# EAGLE design 01 Raspberry Hat 4 Schematic (EAGLE 7.7.0)

## Sheet 1 of 2
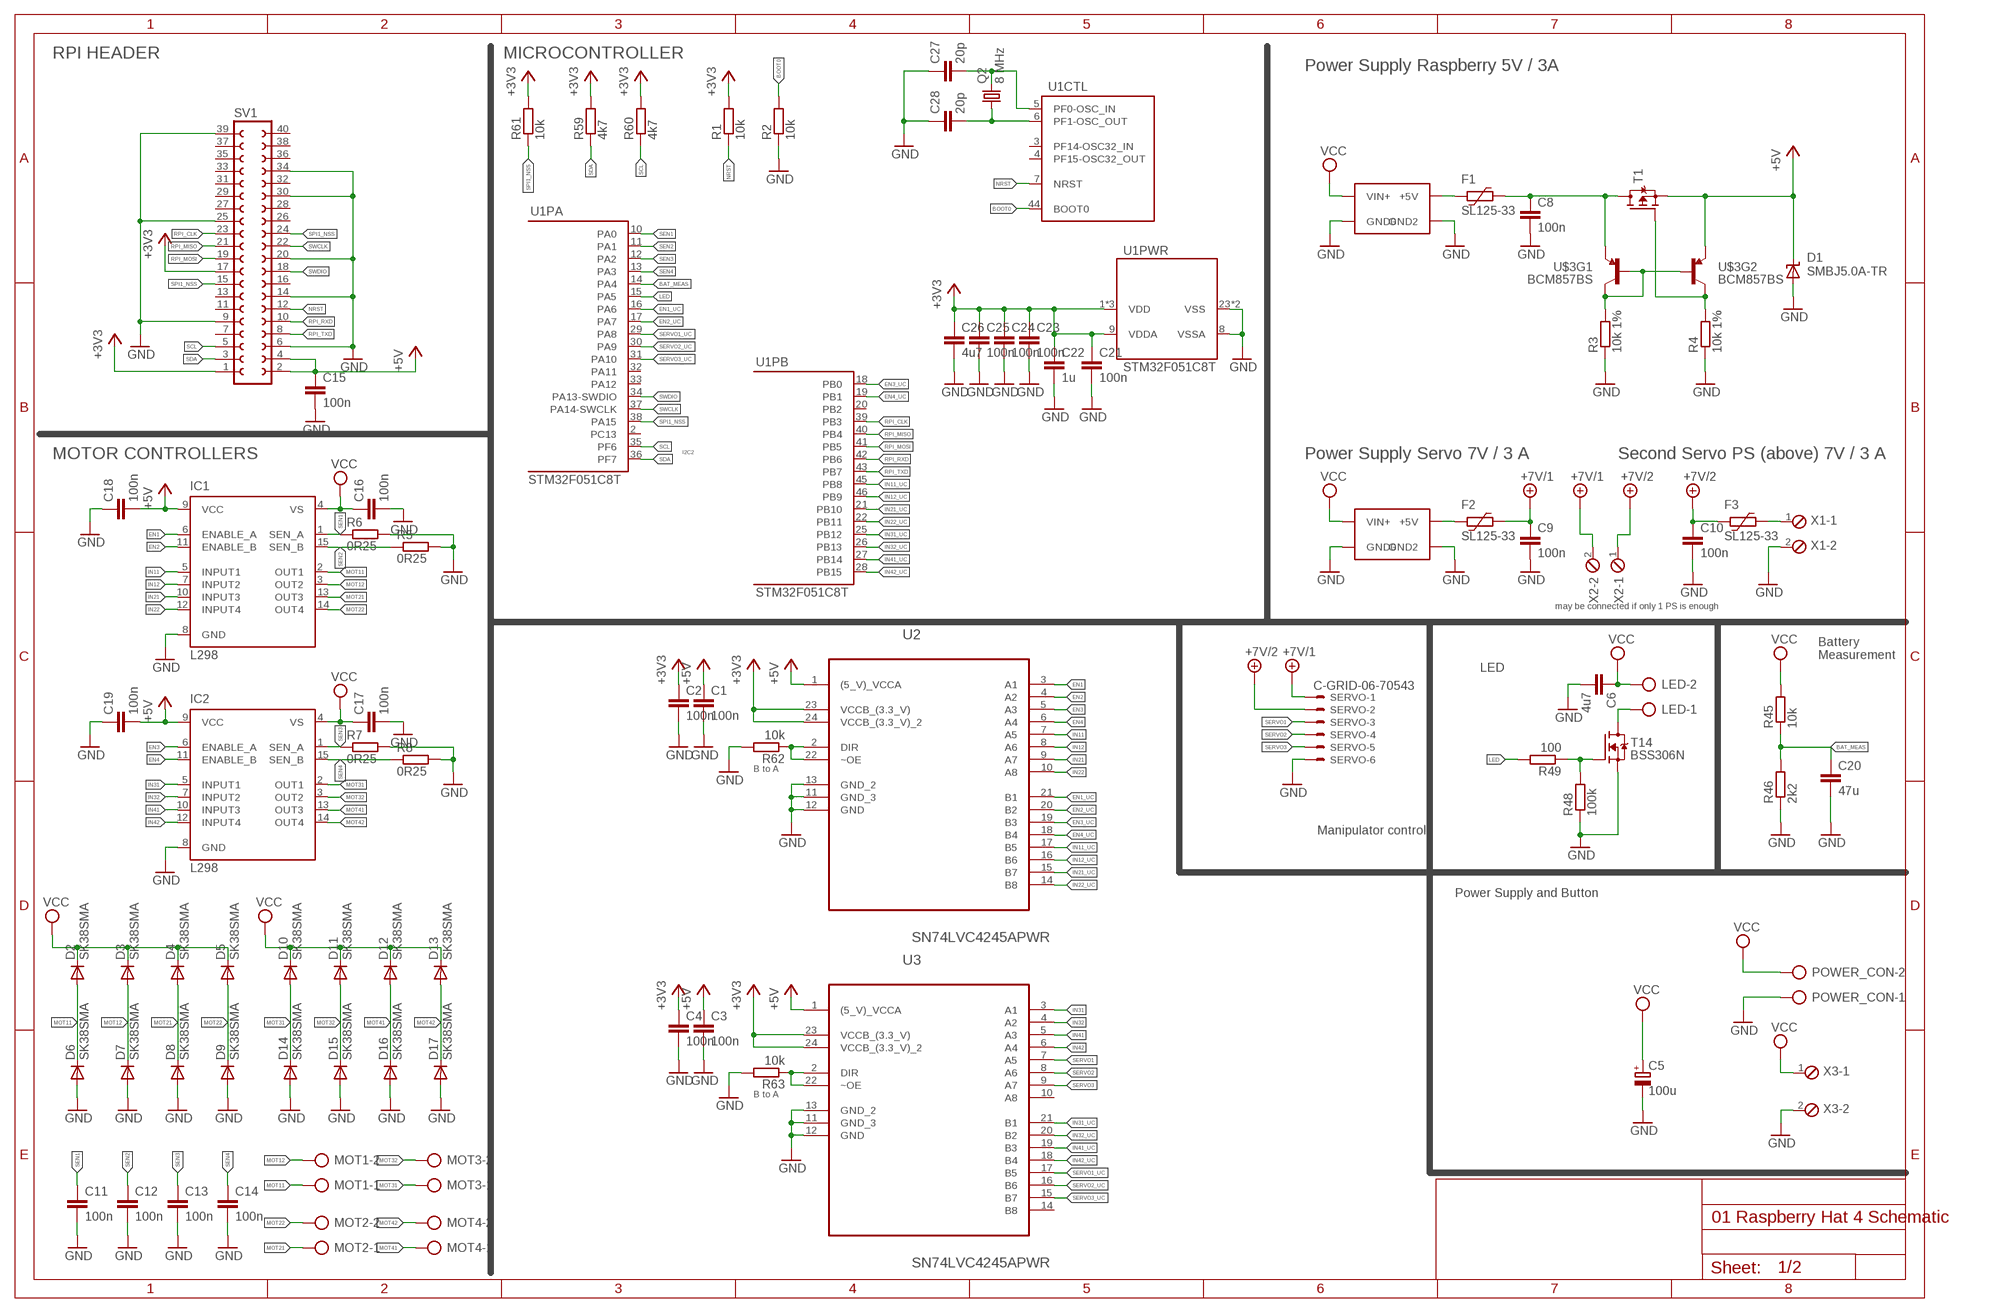
[diagram p0: schematic, sheet 1]

### Parts
C1  100n  C-EUC0805  [C0805]
C2  100n  C-EUC0805  [C0805]
C3  100n  C-EUC0805  [C0805]
C4  100n  C-EUC0805  [C0805]
C5  100u  CPOL-EU153CLV-0807  [153CLV-0807]
C6  4u7  C-EUC0805  [C0805]
C8  100n  C-EUC0805  [C0805]
C9  100n  C-EUC0805  [C0805]
C10  100n  C-EUC0805  [C0805]
C11  100n  C-EUC0805  [C0805]
C12  100n  C-EUC0805  [C0805]
C13  100n  C-EUC0805  [C0805]
C14  100n  C-EUC0805  [C0805]
C15  100n  C-EUC0805  [C0805]
C16  100n  C-EUC0805  [C0805]
C17  100n  C-EUC0805  [C0805]
C18  100n  C-EUC0805  [C0805]
C19  100n  C-EUC0805  [C0805]
C20  47u  C-EUC0805  [C0805]
C21  100n  C-EUC0805  [C0805]
C22  1u  C-EUC0805  [C0805]
C23  100n  C-EUC0805  [C0805]
C24  100n  C-EUC0805  [C0805]
C25  100n  C-EUC0805  [C0805]
C26  4u7  C-EUC0805  [C0805]
C27  20p  C-EUC0805  [C0805]
C28  20p  C-EUC0805  [C0805]
D1  SMBJ5.0A-TR  SUPPRESSOR-SMBJ  [SMBJ]
D2  SK38SMA  DIODE-DO214AC  [DO214AC]
D3  SK38SMA  DIODE-DO214AC  [DO214AC]
D4  SK38SMA  DIODE-DO214AC  [DO214AC]
D5  SK38SMA  DIODE-DO214AC  [DO214AC]
D6  SK38SMA  DIODE-DO214AC  [DO214AC]
D7  SK38SMA  DIODE-DO214AC  [DO214AC]
D8  SK38SMA  DIODE-DO214AC  [DO214AC]
D9  SK38SMA  DIODE-DO214AC  [DO214AC]
D10  SK38SMA  DIODE-DO214AC  [DO214AC]
D11  SK38SMA  DIODE-DO214AC  [DO214AC]
D12  SK38SMA  DIODE-DO214AC  [DO214AC]
D13  SK38SMA  DIODE-DO214AC  [DO214AC]
D14  SK38SMA  DIODE-DO214AC  [DO214AC]
D15  SK38SMA  DIODE-DO214AC  [DO214AC]
D16  SK38SMA  DIODE-DO214AC  [DO214AC]
D17  SK38SMA  DIODE-DO214AC  [DO214AC]
F1  SL125-33  2920L050  [2920L]
F2  SL125-33  2920L050  [2920L]
F3  SL125-33  2920L050  [2920L]
IC1  L298  [MULTIWATT-15]
IC2  L298  [MULTIWATT-15]
LED  AK500/2  [AK500/2]
MOT1  AK500/2  [AK500/2]
MOT2  AK500/2  [AK500/2]
MOT3  AK500/2  [AK500/2]
MOT4  AK500/2  [AK500/2]
POWER_CON  AK500/2  [AK500/2]
Q2  8 MHz  CRYSTALHC49UP  [HC49UP]
R1  10k  R-EU_M0805  [M0805]
R2  10k  R-EU_M0805  [M0805]
R3  10k 1%  R-EU_M0805  [M0805]
R4  10k 1%  R-EU_M0805  [M0805]
R5  0R25  R-EU_R2512  [R2512]
R6  0R25  R-EU_R2512  [R2512]
R7  0R25  R-EU_R2512  [R2512]
R8  0R25  R-EU_R2512  [R2512]
R45  10k  R-EU_M0805  [M0805]
R46  2k2  R-EU_M0805  [M0805]
R48  100k  R-EU_M0805  [M0805]
R49  100  R-EU_M0805  [M0805]
R59  4k7  R-EU_M0805  [M0805]
R60  4k7  R-EU_M0805  [M0805]
R61  10k  R-EU_M0805  [M0805]
R62  10k  R-EU_M0805  [M0805]
R63  10k  R-EU_M0805  [M0805]
SERVO  C-GRID-06-70543  [70543-06]
SV1  FE20-2  [FE20-2]
T1  MOSFET-P-SOT23  [SOT23]
T14  BSS306N  MOSFET-N-SOT23  [SOT23]
U1  STM32F051C8T  [LQFP48]
U2  SN74LVC4245APWR  [SOP65P640X120-24N]
U3  SN74LVC4245APWR  [SOP65P640X120-24N]
U$2  LM2596_CONVERTER  [LM2596_CONVERTER]
U$3  BCM857BS  [SOT363]
U$4  LM2596_CONVERTER  [LM2596_CONVERTER]
X1  MPT2  [2POL254]
X2  MPT2  [2POL254]
X3  MPT2  [2POL254]

### Nets
+3V3: C2.1 C4.1 C21.1 C22.1 C23.1 C24.1 C25.1 C26.1 R1.2 R59.2 R60.2 R61.2 SV1.1 SV1.17 U1.1(PWR:VDD) U1.9(PWR:VDDA) U1.24(PWR:VDD) U1.48(PWR:VDD) U2.23(VCCB_(3.3_V)) U2.24(VCCB_(3.3_V)_2) U3.23(VCCB_(3.3_V)) U3.24(VCCB_(3.3_V)_2)
+5V: C1.1 C3.1 C15.1 C18.2 C19.2 D1.C IC1.9(VCC) IC2.9(VCC) SV1.2 SV1.4 T1.2(S) U2.1((5_V)_VCCA) U3.1((5_V)_VCCA) U$3.4(E)
+7V/1: C9.1 F2.1 SERVO.1 X2.2
+7V/2: C10.1 F3.2 SERVO.2 X2.1
BAT_MEAS: C20.1 R45.1 R46.2 U1.14(PA:PA4)
BOOT0: R2.2 U1.44(CTL:BOOT0)
EN1: IC1.6(ENABLE_A) U2.3(A1)
EN1_UC: U1.16(PA:PA6) U2.21(B1)
EN2: IC1.11(ENABLE_B) U2.4(A2)
EN2_UC: U1.17(PA:PA7) U2.20(B2)
EN3: IC2.6(ENABLE_A) U2.5(A3)
EN3_UC: U1.18(PB:PB0) U2.19(B3)
EN4: IC2.11(ENABLE_B) U2.6(A4)
EN4_UC: U1.19(PB:PB1) U2.18(B4)
GND: C1.2 C2.2 C3.2 C4.2 C5.- C6.2 C8.2 C9.2 C10.2 C11.2 C12.2 C13.2 C14.2 C15.2 C16.2 C17.2 C18.1 C19.1 C20.2 C21.2 C22.2 C23.2 C24.2 C25.2 C26.2 C27.1 C28.1 D1.A D6.A D7.A D8.A D9.A D14.A D15.A D16.A D17.A IC1.8(GND) IC2.8(GND) POWER_CON.1 R2.1 R3.1 R4.1 R5.2 R6.2 R7.2 R8.2 R46.1 R48.1 R62.2 R63.2 SERVO.6 SV1.6 SV1.9 SV1.14 SV1.20 SV1.25 SV1.30 SV1.34 SV1.39 T14.2(S) U1.8(PWR:VSSA) U1.23(PWR:VSS) U1.47(PWR:VSS) U2.11(GND_3) U2.12(GND) U2.13(GND_2) U3.11(GND_3) U3.12(GND) U3.13(GND_2) U$2.GND1(GND2) U$2.GND(GND0) U$4.GND1(GND2) U$4.GND(GND0) X1.2 X3.2
IN11: IC1.5(INPUT1) U2.7(A5)
IN11_UC: U1.45(PB:PB8) U2.17(B5)
IN12: IC1.7(INPUT2) U2.8(A6)
IN12_UC: U1.46(PB:PB9) U2.16(B6)
IN21: IC1.10(INPUT3) U2.9(A7)
IN21_UC: U1.21(PB:PB10) U2.15(B7)
IN22: IC1.12(INPUT4) U2.10(A8)
IN22_UC: U1.22(PB:PB11) U2.14(B8)
IN31: IC2.5(INPUT1) U3.3(A1)
IN31_UC: U1.25(PB:PB12) U3.21(B1)
IN32: IC2.7(INPUT2) U3.4(A2)
IN32_UC: U1.26(PB:PB13) U3.20(B2)
IN41: IC2.10(INPUT3) U3.5(A3)
IN41_UC: U1.27(PB:PB14) U3.19(B3)
IN42: IC2.12(INPUT4) U3.6(A4)
IN42_UC: U1.28(PB:PB15) U3.18(B4)
LED: R49.2 U1.15(PA:PA5)
MOT11: D2.A D6.C IC1.2(OUT1) MOT1.1
MOT12: D3.A D7.C IC1.3(OUT2) MOT1.2
MOT21: D4.A D8.C IC1.13(OUT3) MOT2.1
MOT22: D5.A D9.C IC1.14(OUT4) MOT2.2
MOT31: D10.A D14.C IC2.2(OUT1) MOT3.1
MOT32: D11.A D15.C IC2.3(OUT2) MOT3.2
MOT41: D12.A D16.C IC2.13(OUT3) MOT4.1
MOT42: D13.A D17.C IC2.14(OUT4) MOT4.2
N$1: R62.1 U2.2(DIR) U2.22(~OE)
N$2: R63.1 U3.2(DIR) U3.22(~OE)
N$3: F1.2 U$2.+5V
N$4: C8.1 F1.1 T1.3(D) U$3.1(E)
N$5: F3.1 X1.1
N$6: R4.2 T1.1(G) U$3.3(C)
N$8: R3.2 U$3.2(B) U$3.5(B) U$3.6(C)
N$10: F2.2 U$4.+5V
N$21: R48.2 R49.1 T14.1(G)
N$24: LED.1 T14.3(D)
N$28: C28.2 Q2.1 U1.6(CTL:PF1-OSC_OUT)
N$29: C27.2 Q2.2 U1.5(CTL:PF0-OSC_IN)
NRST: R1.1 SV1.12 U1.7(CTL:NRST)
RPI_CLK: SV1.23 U1.39(PB:PB3)
RPI_MISO: SV1.21 U1.40(PB:PB4)
RPI_MOSI: SV1.19 U1.41(PB:PB5)
RPI_RXD: SV1.10 U1.42(PB:PB6)
RPI_TXD: SV1.8 U1.43(PB:PB7)
SCL: R60.1 SV1.5 U1.35(PA:PF6)
SDA: R59.1 SV1.3 U1.36(PA:PF7)
SEN1: C11.1 IC1.1(SEN_A) R6.1 U1.10(PA:PA0)
SEN2: C12.1 IC1.15(SEN_B) R5.1 U1.11(PA:PA1)
SEN3: C13.1 IC2.1(SEN_A) R7.1 U1.12(PA:PA2)
SEN4: C14.1 IC2.15(SEN_B) R8.1 U1.13(PA:PA3)
SERVO1: SERVO.3 U3.7(A5)
SERVO1_UC: U1.29(PA:PA8) U3.17(B5)
SERVO2: SERVO.4 U3.8(A6)
SERVO2_UC: U1.30(PA:PA9) U3.16(B6)
SERVO3: SERVO.5 U3.9(A7)
SERVO3_UC: U1.31(PA:PA10) U3.15(B7)
SPI1_NSS: R61.1 SV1.15 SV1.24 U1.38(PA:PA15)
SWCLK: SV1.22 U1.37(PA:PA14-SWCLK)
SWDIO: SV1.18 U1.34(PA:PA13-SWDIO)
VCC: C5.+ C6.1 C16.1 C17.1 D2.C D3.C D4.C D5.C D10.C D11.C D12.C D13.C IC1.4(VS) IC2.4(VS) LED.2 POWER_CON.2 R45.2 U$2.IN+(VIN+) U$4.IN+(VIN+) X3.1
Unconnected: SV1.7 SV1.11 SV1.13 SV1.16 SV1.26 SV1.27 SV1.28 SV1.29 SV1.31 SV1.32 SV1.33 SV1.35 SV1.36 SV1.37 SV1.38 SV1.40 U1.2(PA:PC13) U1.3(CTL:PF14-OSC32_IN) U1.4(CTL:PF15-OSC32_OUT) U1.20(PB:PB2) U1.32(PA:PA11) U1.33(PA:PA12) U3.10(A8) U3.14(B8)

### Notes on the sheet
- RPI HEADER | MICROCONTROLLER
- Power Supply Raspberry 5V / 3A
- I2C2
- MOTOR CONTROLLERS | Power Supply Servo 7V / 3 A | Second Servo PS (above) 7V / 3 A
- may be connected if only 1 PS is enough
- Battery
  Measurement
- LED
- B to A
- Manipulator control
- Power Supply and Button
- B to A

## Sheet 2 of 2
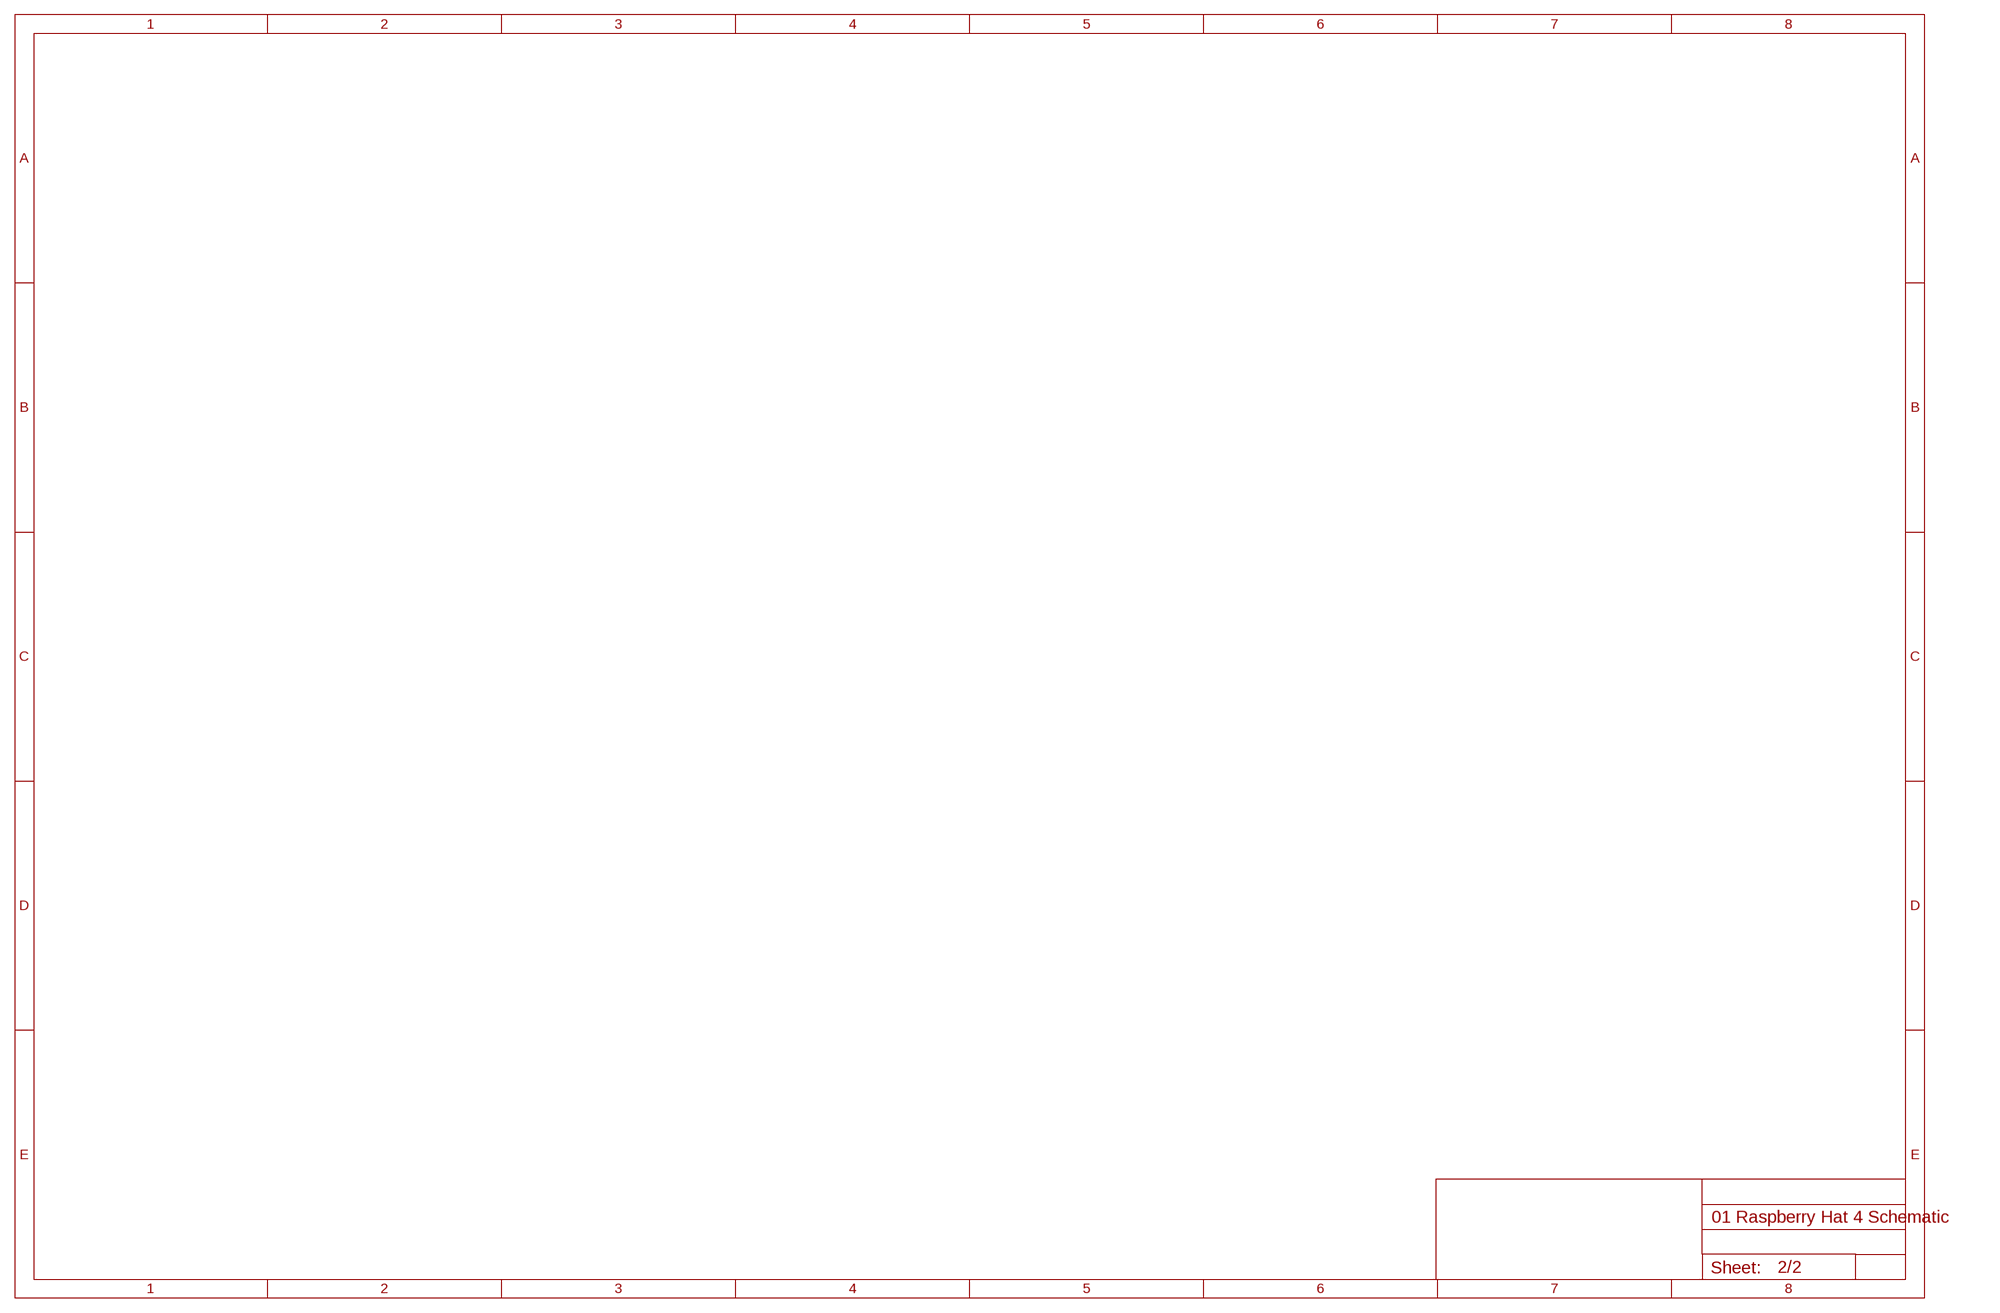
[diagram p1: schematic, sheet 2]

## Library data of the parts
C1-C4 C6 C8-C19 C21-C28 = resistor:C-EU: CAPACITOR, European symbol
C5 = resistor:CPOL-EU: POLARIZED CAPACITOR, European symbol; LINK: http://www.tme.eu/pl/details/sc1e107m0806bvr/kondensatory-elektrolityczne-smd-85c/samwha/
C20 = resistor:C-EU: CAPACITOR, European symbol; LINK: http://www.tme.eu/pl/details/cl21a476mqynnng/kondensatory-mlcc-smd-0805/samsung/
D1 = diode:SUPPRESSOR-: Suppressor diode; LINK: http://www.tme.eu/pl/details/smbj5.0a-tr/diody-transil-smd-jednokierunkowe/st-microelectronics/
D2-D17 = diode:DIODE-: DIODE; LINK: http://www.tme.eu/pl/details/sk38sma-dio/diody-schottky-smd/diotec-semiconductor/sk38sma/
F1 = polyfuse-smd_10:?: Polyfuse Resettable PTC Source: http://www.littelfuse.com/products/resettable-ptcs.aspx; LINK: http://www.tme.eu/pl/details/sl125-33/bezpieczniki-polimerowe-smd/ece/; MF: Littelfuse; MPN: 2920L050; OC_FARNELL: 1822223; OC_NEWARK: 18M4790
F2 F3 = polyfuse-smd_10:?: Polyfuse Resettable PTC Source: http://www.littelfuse.com/products/resettable-ptcs.aspx; LINK: http://www.tme.eu/pl/details/sl075-33/bezpieczniki-polimerowe-smd/ece/; MF: Littelfuse; MPN: 2920L050; OC_FARNELL: 1822223; OC_NEWARK: 18M4790
IC1 IC2 = st-microelectronics:L298: DUAL FULL-BRIDGE DRIVER; MPN: L298N; OC_FARNELL: 1589425; OC_NEWARK: 32M1527
LED MOT1-MOT4 POWER_CON = con-ptr500:AK500/2: CONNECTOR; OC_FARNELL: unknown; OC_NEWARK: unknown
Q2 = crystal:CRYSTAL: CRYSTAL; LINK: YIC 49SLMT 8.00MHZ 20PF 30PPM; OC_FARNELL: unknown; OC_NEWARK: unknown
R1-R4 R45 R46 R48 R49 R59-R63 = resistor:R-EU_: RESISTOR, European symbol
R5-R8 = rcl:R-EU_: RESISTOR, European symbol; LINK: http://www.tme.eu/pl/details/cs2512-0r25-1%25-hp/rezystory-smd-2512/viking/cs12ftfsr250/
SERVO = con-molex:C-GRID-06: CONNECTOR wire to board 2.54 mm (0.100") pitch header; LINK: http://www.tme.eu/pl/details/ncdw-06/zlacza-sygnalowe-raster-254mm/ninigi/; OC_FARNELL: unknown; OC_NEWARK: unknown
SV1 = con-lsta:FE20-2: FEMALE HEADER; OC_FARNELL: unknown; OC_NEWARK: unknown
T1 = we-transistor:MOSFET-P: P-Channel MOSFET (e.g. IRLML6402); LINK: http://www.tme.eu/pl/details/dmp2305u-7/tranzystory-z-kanalem-p-smd/diodes-incorporated/
T14 = we-transistor:MOSFET-N: N-Channel MOSFET (e.g. IRLML2502, BSS138)
U1 = STM32F030:STM32F051C: STM32F051 in LQPF48 package. STM32F0-series Cortex-M0 microcontroller in a 48 lead package. Datasheet <http://www.st.com/web/en/resource/technical/document/datasheet/DM00039193.pdf> (DM00039193.pdf) .; FLASH: 64K
U2 U3 = Texas Instruments_By_element14_Batch_1:SN74LVC4245APWR: OCTAL BUS TRANSCEIVER AND 3.3-V TO 5-V SHIFTER WITH 3-STATE OUTPUTS; MPN: SN74LVC4245APWR; OC_FARNELL: 1470935; OC_NEWARK: 92B8894; PACKAGE: TSSOP-24; SUPPLIER: Texas Instruments
U$2 U$4 = Voltage Converter:LM2596_CONVERTER: https://botland.com.pl/przetwornice-step-down/2967-przetwornica-step-down-lm2596-15v-35v-3a.html?search_query=przetwornica+step-down&results=71 HEIGHT 14 mm
U$3 = BCM857BS:BCM857BS: NPN/PNP transistor pair in SOT-363 package http://www.tme.eu/pl/Document/3ea3302220f52372b0e794796e7ba661/BCM847BS.pdf http://www.tme.eu/pl/details/bcm857bs/tranzystory-pnp-smd/nxp/; LINK: http://www.tme.eu/pl/details/bcm857bs/tranzystory-pnp-smd/nxp/
X1-X3 = con-phoenix-254:MPT2: PHOENIX CONNECTOR; OC_FARNELL: unknown; OC_NEWARK: unknown

## Board
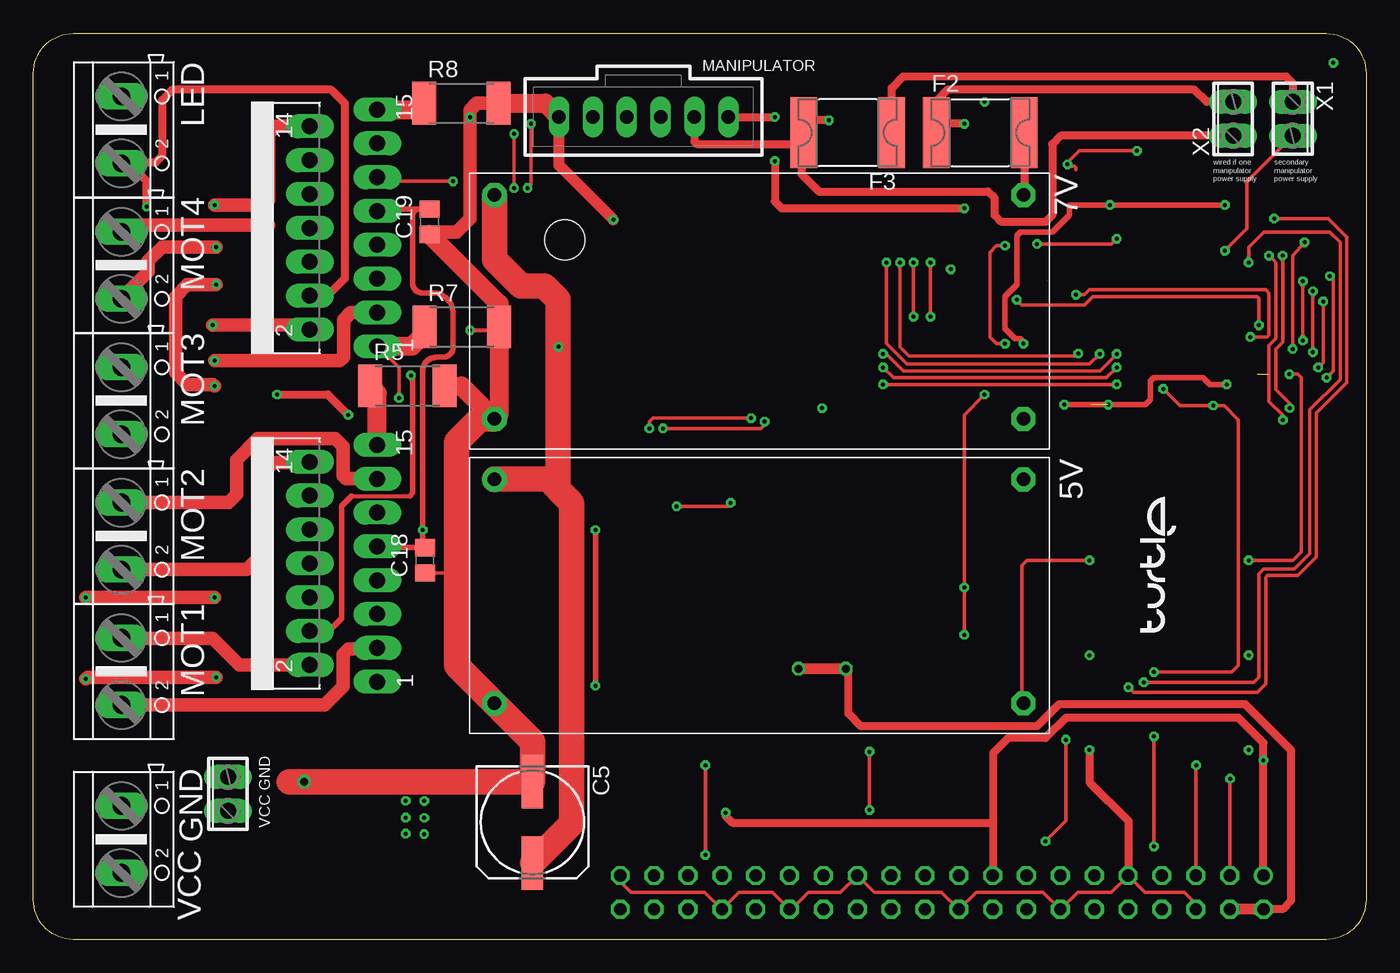
[diagram p2: board, top side]
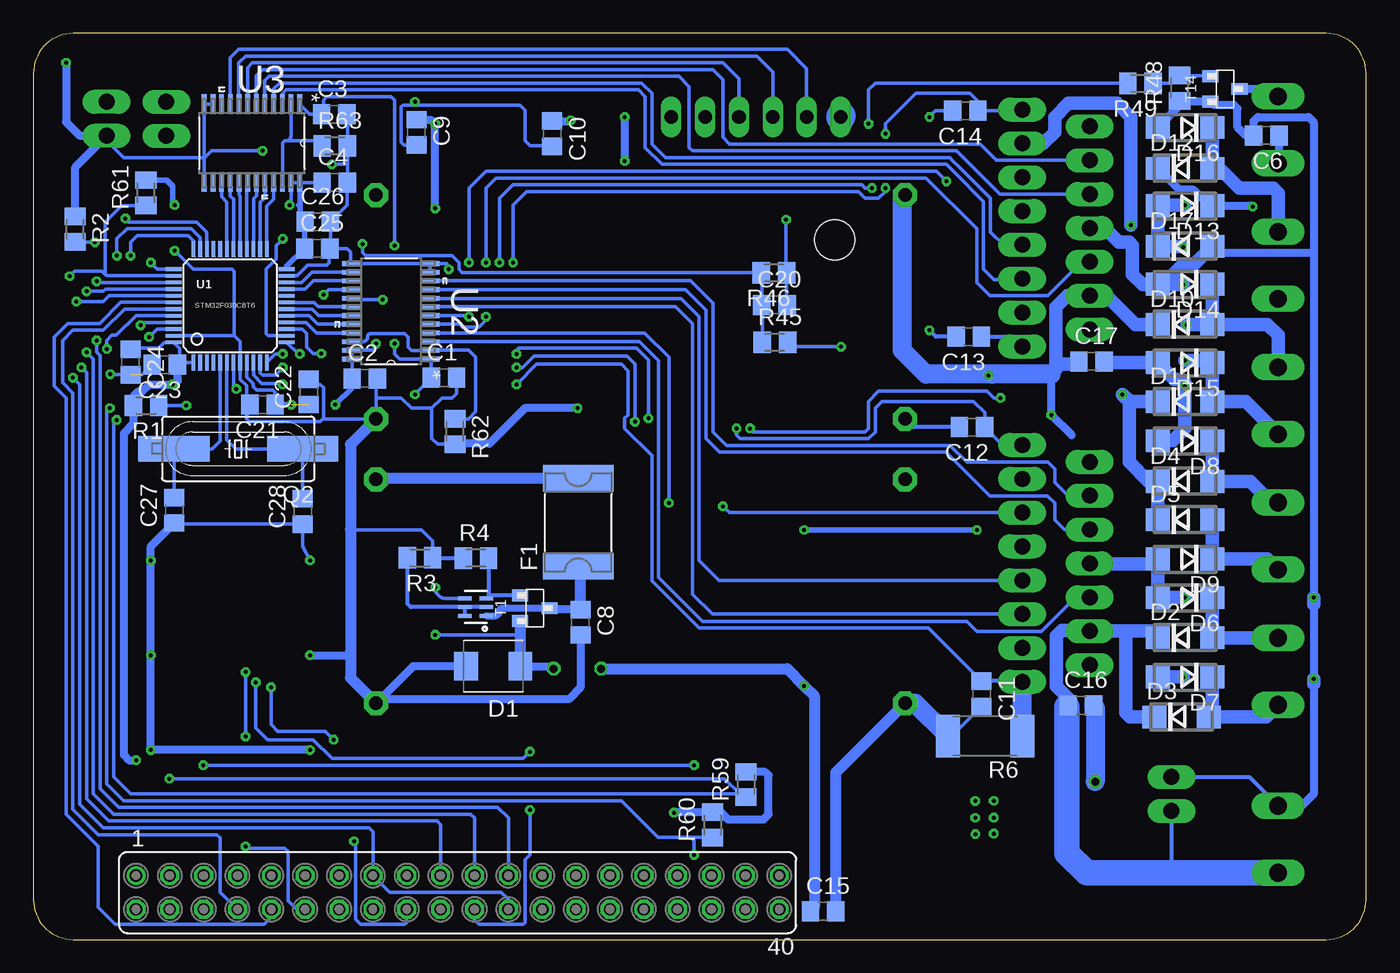
[diagram p3: board, bottom side, seen from below]

Size 100 x 68 mm. Coordinates in mm from the lower left corner, seen from the top.
Outline: 0,65 arc-90 3,68 97,68 arc-90 100,65 100,3 arc-90 97,0 3,0 arc-90 0,3 0,65
Copper layers (1*16): Top 0.035mm / dielectric 1.5mm / Bottom 0.035mm
Design rules "default *": minimum track width 10mil, minimum drill 0.3mm, track to track 8mil, track to pad 8mil, pad to pad 8mil, via to via 8mil, smd to smd 8mil, copper to edge 40mil, drill to drill 8mil, minimum pad ring 10mil, minimum via ring 8mil, stop-mask expansion 4mil, vias tented up to drill 0mil, thermal gap 10mil
Holes 3 mm at 39.87,52.5

### Footprints (pad centres in the part's own frame; a part is rotated, then mirrored left to right if it is on the bottom)
C0805 = smd 1.3 x 1.5: 1 -0.95,0; 2 0.95,0
153CLV-0807 = smd 4 x 1.6: + 3.05,0; - -3.05,0
SMBJ = smd 1.78 x 2.16: A 2.04,0; C -2.03,0
DO214AC = smd 1.8 x 1.7: A 2.05,0; C -2.05,0
2920L = smd 2 x 5.3: 1 -3.3,0; 2 3.3,0
MULTIWATT-15 = drill 1.2 long: 1 -8.89,-7.62; 2 -7.62,-2.54; 3 -6.35,-7.62; 4 -5.08,-2.54; 5 -3.81,-7.62; 6 -2.54,-2.54; 7 -1.27,-7.62; 8 0,-2.54; 9 1.27,-7.62; 10 2.54,-2.54; 11 3.81,-7.62; 12 5.08,-2.54; 13 6.35,-7.62; 14 7.62,-2.54; 15 8.89,-7.62
AK500/2 = drill 1.321 long: 1 -2.515,0; 2 2.515,0
HC49UP = smd 5.334 x 1.93: 1 -4.826,0; 2 4.826,0
M0805 = smd 1.3 x 1.6: 1 -0.95,0; 2 0.95,0
R2512 = smd 1.8 x 3.2: 1 -2.8,0; 2 2.8,0
70543-06 = drill 1.016 long: 1 -6.35,0; 2 -3.81,0; 3 -1.27,0; 4 1.27,0; 5 3.81,0; 6 6.35,0
FE20-2 = drill 0.914: 1 -24.13,1.27 | drill 0.914 octagon: 2 -24.13,-1.27; 3 -21.59,1.27; 4 -21.59,-1.27; 5 -19.05,1.27; 6 -19.05,-1.27; 7 -16.51,1.27; 8 -16.51,-1.27; 9 -13.97,1.27; 10 -13.97,-1.27; 11 -11.43,1.27; 12 -11.43,-1.27; 13 -8.89,1.27; 14 -8.89,-1.27; 15 -6.35,1.27; 16 -6.35,-1.27; 17 -3.81,1.27; 18 -3.81,-1.27; 19 -1.27,1.27; 20 -1.27,-1.27; 21 1.27,1.27; 22 1.27,-1.27; 23 3.81,1.27; 24 3.81,-1.27; 25 6.35,1.27; 26 6.35,-1.27; 27 8.89,1.27; 28 8.89,-1.27; 29 11.43,1.27; 30 11.43,-1.27; 31 13.97,1.27; 32 13.97,-1.27; 33 16.51,1.27; 34 16.51,-1.27; 35 19.05,1.27; 36 19.05,-1.27; 37 21.59,1.27; 38 21.59,-1.27; 39 24.13,1.27; 40 24.13,-1.27
SOT23 = smd 1.3 x 0.9: 1 -1.1,0.95; 2 -1.1,-0.95; 3 1.1,0
LQFP48 = smd 0.28 x 1.2: 1 -2.75,-4.25; 2 -2.25,-4.25; 3 -1.75,-4.25; 4 -1.25,-4.25; 5 -0.75,-4.25; 6 -0.25,-4.25; 7 0.25,-4.25; 8 0.75,-4.25; 9 1.25,-4.25; 10 1.75,-4.25; 11 2.25,-4.25; 12 2.75,-4.25; 25 2.75,4.25; 26 2.25,4.25; 27 1.75,4.25; 28 1.25,4.25; 29 0.75,4.25; 30 0.25,4.25; 31 -0.25,4.25; 32 -0.75,4.25; 33 -1.25,4.25; 34 -1.75,4.25; 35 -2.25,4.25; 36 -2.75,4.25 | smd 1.2 x 0.28: 13 4.25,-2.75; 14 4.25,-2.25; 15 4.25,-1.75; 16 4.25,-1.25; 17 4.25,-0.75; 18 4.25,-0.25; 19 4.25,0.25; 20 4.25,0.75; 21 4.25,1.25; 22 4.25,1.75; 23 4.25,2.25; 24 4.25,2.75; 37 -4.25,2.75; 38 -4.25,2.25; 39 -4.25,1.75; 40 -4.25,1.25; 41 -4.25,0.75; 42 -4.25,0.25; 43 -4.25,-0.25; 44 -4.25,-0.75; 45 -4.25,-1.25; 46 -4.25,-1.75; 47 -4.25,-2.25; 48 -4.25,-2.75
SOP65P640X120-24N = smd 1.473 x 0.356: 1 -2.921,3.581; 2 -2.921,2.921; 3 -2.921,2.286; 4 -2.921,1.626; 5 -2.921,0.965; 6 -2.921,0.33; 7 -2.921,-0.33; 8 -2.921,-0.965; 9 -2.921,-1.626; 10 -2.921,-2.286; 11 -2.921,-2.921; 12 -2.921,-3.581; 13 2.921,-3.581; 14 2.921,-2.921; 15 2.921,-2.286; 16 2.921,-1.626; 17 2.921,-0.965; 18 2.921,-0.33; 19 2.921,0.33; 20 2.921,0.965; 21 2.921,1.626; 22 2.921,2.286; 23 2.921,2.921; 24 2.921,3.581
LM2596_CONVERTER = drill 1 pad 1.8 octagon: +5V 1.65,41.55; GND 18.45,1.85; GND1 18.45,41.55; IN+ 1.65,1.85
SOT363 = smd 0.3 x 0.99: 1 -0.65,-0.8; 2 0,-0.8; 3 0.65,-0.8; 4 0.65,0.81; 5 0,0.81; 6 -0.65,0.81
2POL254 = drill 1.2 long: 1 -1.27,0; 2 1.27,0

### Placement (x,y rotation side)
C1  69.2,42.16 0 bottom
C2  75.13,42.11 0 bottom
C3  77.42,61.93 0 bottom
C4  77.38,56.81 0 bottom
C5  37.45,8.8 270 top
C6  7.49,60.33 180 bottom
C8  58.95,23.81 270 bottom
C9  71.25,60.57 270 bottom
C10  61.06,60.46 270 bottom
C11  28.86,18.44 270 bottom
C12  29.57,38.44 180 bottom
C13  29.82,45.23 180 bottom
C14  30.08,62.18 180 bottom
C15  40.74,2.12 0 bottom
C16  21.39,17.57 0 bottom
C17  20.6,43.38 0 bottom
C18  29.38,28.46 90 top
C19  29.73,53.86 90 top
C20  44.4,47.62 0 bottom
C21  82.81,40.14 180 bottom
C22  79.33,41.09 90 bottom
C23  90.13,43.14 180 bottom
C24  92.71,43.34 270 bottom
C25  78.7,51.86 0 bottom
C26  78.66,53.86 0 bottom
C27  89.42,32.21 90 bottom
C28  79.78,32.12 90 bottom
D1  65.49,20.51 180 bottom
D2  13.59,22.64 0 bottom
D3  13.85,16.7 0 bottom
D4  13.59,34.37 0 bottom
D5  13.59,31.49 0 bottom
D6  13.59,25.65 180 bottom
D7  13.59,19.71 180 bottom
D8  13.59,37.43 180 bottom
D9  13.59,28.56 180 bottom
D10  13.59,46.15 0 bottom
D11  13.59,40.36 0 bottom
D12  13.59,57.87 0 bottom
D13  13.59,55.07 180 bottom
D14  13.59,49.18 180 bottom
D15  13.59,43.29 180 bottom
D16  13.59,60.93 180 bottom
D17  13.59,52.01 0 bottom
F1  59.12,31.31 90 bottom
F2  71.04,60.54 0 top
F3  61.1,60.54 180 top
IC1  18.19,28.22 90 top
IC2  18.19,53.4 90 top
LED  6.6,60.76 270 top
MOT1  6.6,20.12 270 top
MOT2  6.6,30.28 270 top
MOT3  6.6,40.44 270 top
MOT4  6.6,50.6 270 top
POWER_CON  6.6,7.52 270 top
Q2  84.63,36.82 180 bottom
R1  91.54,40.07 180 bottom
R2  96.85,53.3 270 bottom
R3  70.99,28.64 180 bottom
R4  66.8,28.62 0 bottom
R5  28.07,41.54 0 top
R6  28.58,15.27 180 bottom
R7  32.15,45.98 0 top
R8  32.12,62.76 0 top
R45  44.36,44.8 0 bottom
R46  44.43,50.04 180 bottom
R48  14,63.89 90 bottom
R49  16.93,64.24 180 bottom
R59  46.53,11.63 90 bottom
R60  49.04,8.6 90 bottom
R61  91.56,56.04 90 bottom
R62  68.36,38.12 270 bottom
R63  77.38,59.54 0 bottom
SERVO  45.79,61.72 180 top
SV1  68.17,3.53 0 bottom
T1  62.38,24.86 0 bottom
T14  10.6,63.83 0 bottom
U1  85.23,47.56 0 bottom
U2  73.16,47.14 180 bottom
U3  83.59,59.76 270 bottom
U$2  32.74,36.18 270 top
U$3  66.81,24.94 90 bottom
U$4  32.74,57.52 270 top
X1  94.49,61.58 270 top
X2  90.02,61.58 90 top
X3  14.61,10.92 90 top

### Tracks (layer width: path | path; a pad name or v marks a point on that pad's centre or on a via)
+3V3  (via drill 0.3)  (1 unrouted)
  Top 0.406: v89.41,55.12 v80.77,55.12 77.72,55.12 77.72,54.36 76.45,53.09 74.04,53.09 73.79,52.83 73.79,49.15 72.9,48.26 72.9,45.85 73.66,45.09 74.04,45.09 74.3,44.83 v74.3,44.7 | v80.64,40.13 83.44,40.13 83.82,40.51 83.82,41.91 84.07,42.16 87.76,42.16 88.27,41.66 v89.53,41.66 | v80.65,40.14 v80.64,40.13 | v80.64,40.13 v77.34,40.13
  Top 0.61: SV1.17 72.01,4.83 72.01,8.64 | SV1.1 v92.3,13.46 92.3,14.76 90.42,16.64 77.47,16.64 75.95,15.11 73.15,15.11 72.01,13.97 72.01,8.64 | v51.94,9.53 51.94,9.27 52.45,8.76 71.88,8.76 72.01,8.64
  Bottom 0.254: C24.1 92.55,44.4 90.6,44.4 90.19,44.81 U1.48 89.01,44.34 89.01,43.31 | 89.48,43.04 C23.1 89.01,43.31 | U1.1 89.01,43.31 | 79.71,51.8 C25.1 | C2.1 U2.24 U2.23 74.55,44.21 74.3,44.47 v74.3,44.7 | 79.98,56.81 U3.24 | 49.02,9.53 R60.2 | U1.9 83.98,42.2 83.49,41.71 83.49,41.48 83.24,41.22 82.04,41.22 81.86,41.04 C21.1 82.04,40.32 | v80.77,55.12 80.67,55.22 U3.23 80.64,56.81 79.98,56.81 | 79.98,56.81 C4.1
  Bottom 0.305: 80.98,50.53 U1.24
  Bottom 0.406: 80.98,50.53 C25.1 79.65,53.82 C26.1 79.98,54.23 79.98,55.24 | 79.98,56.81 79.98,55.24 | R61.2 90.01,56.99 89.53,56.52 89.53,55.24 v89.41,55.12 | 80.11,55.12 79.98,55.24 | C21.1 v80.65,40.14 v80.64,40.13 | v89.53,41.66 89.15,42.04 | v77.34,40.13 76.08,41.39 C2.1
  Bottom 0.61: R59.2 45.09,12.57 44.83,12.32 44.83,9.4 45.21,9.02 47.88,9.02 48.42,9.55 R60.2 51.91,9.55 v51.94,9.53 | v92.3,13.46 92.84,13.46 93.22,13.84 93.22,37.97 92.49,38.7 R1.2 92.49,40.73 92.08,41.15 91.82,41.15 91.31,41.66 v89.53,41.66 89.41,41.66 89.15,41.91 89.15,42.04 89.15,43.11 C23.1
+5V  (via drill 0.3, 0.6)
  Top 0.254: 29.29,29.49 C18.2 | v69.85,22.86 v69.85,26.42 69.85,39.37 v71.37,40.89 | v72.9,44.7 72.26,44.7 71.75,45.21 71.75,51.56 72.26,52.07 v72.9,52.07
  Top 0.406: IC2.9 25.96,54.81 28.96,54.81 | 28.96,54.81 C19.2 | IC1.9 25.9,29.41 C18.2 29.21,29.58 v29.21,30.73 29.21,42.67 arc-90 30.23,43.69 30.73,43.69 arc90 31.5,44.45 31.5,46.99 arc90 29.97,48.51 29.21,48.51 arc-90 28.45,49.28 28.45,54.3 arc-90 28.96,54.81 | v42.16,30.73 v42.16,19.05
  Top 0.61: SV1.2 92.32,2.29 93.73,2.29 94.36,2.92 94.36,14.22 90.93,17.65 76.96,17.65 75.31,16 62.1,16 61.15,16.96 61.15,20.13 v60.96,20.32
  Top 0.813: SV1.2 SV1.4 | v60.96,20.32 v57.4,20.32
  Bottom 0.254: U$3.4 69.02,25.59 arc90 v69.85,26.42 | v69.85,22.86 63.73,22.86 arc90 63.48,22.61 | v71.37,40.89 71.37,40.93 C1.1 70.15,43.47 U2.1 72.52,43.56 72.9,43.94 v72.9,44.7 | v72.9,52.07 72.9,62.99 73.15,63.25 77.98,63.25 78.23,62.99 78.23,62.07 C3.1 79.26,61.93 U3.1
  Bottom 0.406: v29.21,30.73 v42.16,30.73
  Bottom 0.61: D1.C 61.15,20.51 v60.96,20.32
  Bottom 0.813: T1.2 63.48,22.61 63.48,20.52 D1.C | v57.4,20.32 43.43,20.32 v42.16,19.05 41.4,18.29 41.4,2.41 C15.1
+7V/1  (via drill 0.3)
  Top 0.61: X2.2 88.03,62.85 87.12,63.75 68.58,63.75 67.82,62.99 67.82,61.21 | 67.82,61.21 67.82,60.87 F2.1 | SERVO.1 v55.63,61.72 | v55.63,58.42 55.63,55.37 56.13,54.86 v69.85,54.86 | v69.85,61.21 67.82,61.21
  Bottom 0.61: v55.63,61.72 v55.63,58.42 | v69.85,54.86 v69.85,61.21 70.1,61.47 71.08,61.47 C9.1
+7V/2  (via drill 0.3)
  Top 0.61: X2.1 77.07,60.31 76.45,59.69 76.45,54.36 75.95,53.85 72.64,53.85 72.14,54.36 72.14,55.63 71.63,56.13 58.93,56.13 57.66,57.4 57.66,59.44 | 57.66,59.44 57.66,60.4 F3.2 | SERVO.2 49.6,59.88 49.78,59.69 56.95,59.69 F3.2 | 57.4,59.18 57.66,59.44 | v59.69,61.47 58.73,61.47 F3.2
  Bottom 0.61: C10.1 59.74,61.41 v59.69,61.47
BAT_MEAS  (via drill 0.3)
  Top 0.254: v75.31,52.2 80.9,52.2 v81.28,52.58
  Bottom 0.254: U1.14 82.39,45.31 82.55,45.47 82.55,50.29 81.79,51.05 81.79,52.07 v81.28,52.58 | v75.31,52.2 75.31,51.56 75.06,51.31 68.58,51.31 68.07,50.8 68.07,50.29 67.82,50.04 46.74,50.04 46.73,50.04 R46.2 45.35,50.01 C20.1 45.31,47.58 R45.1
BOOT0  (via drill 0.3)
  Top 0.254: v94.49,44.32 94.49,51.31 v95.38,52.32
  Bottom 0.254: v95.38,52.32 96.82,52.32 arc90 R2.2 | U1.44 92.3,46.81 93.77,45.34 94.11,45.34 94.49,44.96 v94.49,44.32
EN1
  Bottom 0.254: IC1.6 21.81,25.68 24.38,23.11 29.21,23.11 29.97,23.88 49.78,23.88 53.09,27.18 53.09,43.43 54.51,44.86 U2.3
EN1_UC
  Bottom 0.254: U1.16 79.54,46.31 78.76,45.52 U2.21
EN2  (via drill 0.3)
  Top 0.254: v48.26,32.51 52.07,32.51 v52.32,32.77
  Bottom 0.254: IC1.11 47.78,32.03 v48.26,32.51 | v52.32,32.77 52.32,43.69 54.15,45.52 U2.4
EN2_UC
  Bottom 0.254: U1.17 79.31,46.81 78.68,46.18 U2.20 | U2.20
EN3  (via drill 0.3)
  Top 0.254: v66.04,46.74 v66.04,50.8
  Bottom 0.254: U2.5 68.02,46.18 67.82,45.97 66.55,45.97 66.04,46.48 v66.04,46.74 | v66.04,50.8 66.04,56.39 65.28,57.15 33.02,57.15 29.21,53.34 29.21,49.28 28.25,48.31 23.88,48.31 21.33,50.86 IC2.6
EN3_UC
  Bottom 0.254: U1.18 79.09,47.31 78.61,46.82 U2.19
EN4  (via drill 0.3)
  Top 0.254: v67.31,46.74 v67.31,50.8 | v31.5,56.9 26.12,56.9 IC2.11
  Bottom 0.254: U2.6 67.39,46.81 v67.31,46.74 | v67.31,50.8 67.31,56.39 66.04,57.66 32.26,57.66 v31.5,56.9
EN4_UC
  Bottom 0.254: U1.19 78.92,47.81 78.61,47.5 76.11,47.5 U2.18
GND  (via drill 0.3, 0.6)  (1 unrouted)
  Top 0.254: C18.1 31.42,27.51 31.75,27.18 | v82.8,59.18 78.49,59.18 77.47,58.17 | SV1.6 87.22,2.7 86.36,3.56 83.38,3.56 SV1.9 80.89,3.56 78.36,3.56 SV1.14 75.76,3.56 70.74,3.56 SV1.20 68.14,3.56 63.12,3.56 61.88,4.8 SV1.25 60.57,3.56 58.17,3.56 56.87,2.26 SV1.30 55.44,3.56 52.96,3.56 SV1.34 50.36,3.56 44.83,3.56 44.04,4.35 SV1.39 | v79.25,28.45 74.55,28.45 74.17,28.07 74.17,17.85 U$2.GND1 | v94.23,42.42 94.87,42.42 95.12,42.16 95.12,29.08 94.49,28.45 v91.19,28.45 | v89.41,51.69 91.06,53.34 91.06,56.88 X1.2 | v77.6,58.17 77.72,58.04 78.11,58.04 78.23,57.91 78.23,57.78
  Top 0.305: v32.77,45.72 34.69,45.72 R7.2
  Top 0.61: v79.25,14.22 79.25,11.81 82.17,8.89 82.17,4.83 SV1.9
  Top 0.813: 39.37,61.65 SERVO.6 39.44,58.1 v43.52,54.02
  Top 1.016: 35.31,62.74 33.27,62.74 32.77,62.23 v32.77,61.72 32.77,54.1 31.75,53.09 29.46,53.09 30.05,52.49 30.14,52.49 | v13.72,49.15 11.56,49.15 10.67,48.26 10.67,42.55 11.56,41.66 13.46,41.66 v13.59,41.53 | v13.59,25.65 v3.94,25.65 | v13.72,19.68 4.06,19.68 v3.94,19.56
  Top 1.422: R5.2 32.12,41.54 U$4.GND 34.95,39.42 R7.2 34.95,47.69 30.14,52.49 C19.1 | R8.2 38.4,62.76 SERVO.6
  Top 1.93: U$4.GND 33.48,39.07 31.75,37.34 31.75,27.18 31.75,20.57 U$2.GND 37.45,14.87 C5.- v20.32,11.85 19.18,11.85
  Bottom 0.254: 84,40.58 C21.2 | C25.2 76.46,51.86 76.2,51.6 76.2,50.84 U2.13 U2.12 | U1.23 80.19,49.81 79.4,50.6 78,50.6 77.8,50.8 77.8,51.81 C25.2 | C25.2 77.71,51.9 C26.2 76.45,55.12 76.45,56.79 C4.2 76.43,58.17 | C11.2 31.08,15.27 | C14.2 32.31,62.18 v32.77,61.72 | 84,40.58 84,39.04 83.82,38.86 78.49,38.86 78.28,39.07 | 78.28,39.07 78.23,39.12 78.23,41.4 78.49,41.66 79.07,41.66 C22.2 | 84,40.58 84,41.55 84.48,42.03 U1.8 84.48,44.85 84.93,45.31 | 87.17,58.62 U3.12 U3.11 | 76.43,58.17 R63.2 76.43,61.89 C3.2 | 78.28,39.07 U$4.GND1 74.29,40.64 | 74.29,40.64 74.29,42 C2.2 | C1.2 68.25,40.97 68.58,40.64 69.34,40.64 70.1,39.88 | R62.2 69.68,37.17 70.1,37.59 70.1,39.88 | U2.12 U2.11 | 91.83,42.39 C23.2 | U1.47 84.93,45.31 | C27.1 89.33,31.17 C28.1 79.78,29.49 v79.25,28.45 | R3.1 70.04,29.91 70.87,30.73 76.2,30.73 | 74.29,40.64 72.39,40.64 71.63,39.88 70.1,39.88 | U3.13 87.17,58.55 | 87.17,58.55 87.17,58.62 | 87.17,58.62 86.61,59.18 v82.8,59.18 | U2.12 69.01,50.72 68.83,50.55 v68.83,50.29 | X1.2 94.49,59.95 93.22,58.67 87.3,58.67 87.17,58.55 | C9.2 72.19,59.62 72.39,59.82 72.39,62.48 72.26,62.61 63.5,62.61 63.12,62.23 63.12,59.94 62.74,59.56 61.11,59.56 C10.2 | C24.2 94.2,42.39 v94.23,42.42 | 84.93,45.31 84.93,50.13 85.09,50.29 88.01,50.29 v89.41,51.69 | v43.52,54.02 43.52,50.08 R46.1 43.48,47.65 C20.2 | 11.75,62.94 T14.2 | 76.43,58.17 v77.6,58.17
  Bottom 0.305: 31.08,15.27 R6.2 | C12.2 33.97,38.44 U$4.GND | C13.2 32.28,45.23 v32.77,45.72 | R3.1 67.77,28.64 R4.1 | X3.2 8.76,12.19 POWER_CON.1
  Bottom 0.61: R2.1 96.85,57.96 X1.2 94.5,60.33 96.52,60.33 97.54,61.34 v97.54,65.79 | C27.1 91.19,29.5 v91.19,28.45 v91.19,21.34 v91.19,14.22 v79.25,14.22 | v79.25,21.34 76.45,21.34 76.2,21.59 | D1.A 71.52,20.51 U$2.GND1 73.99,18.03 59.82,18.03 58.95,18.9 C8.2 | v59.18,39.88 63.12,39.88 65.79,37.21 68.32,37.21 R62.2 | 13.95,62.88 T14.2 11.43,62.61 9.91,62.61 9.65,62.36 9.65,60.96 9.02,60.33 | 13.95,62.88 R48.1 | 13.95,62.88 13.95,62.63 D16.A | C6.2 8.44,61.41 8.13,61.72 4.32,61.72 3.94,61.34 3.94,51.56 | D17.A 11.1,51.56 3.94,51.56 | 3.94,51.56 v3.94,25.65 | 3.94,25.15 v3.94,19.56 | 3.94,19.18 3.94,10.92 4.83,10.03 POWER_CON.1
  Bottom 0.813: C15.2 39.79,12.53 U$2.GND | U$2.GND1 76.2,19.64 76.2,21.59 76.2,30.73 76.2,37.16 U$4.GND1
  Bottom 1.016: IC2.8 19.61,53.4 18.54,52.32 17.78,52.32 17.53,52.07 17.53,49.91 16.76,49.15 15.68,49.15 | 15.68,49.15 D14.A 15.21,49.18 13.72,50.67 12.88,50.67 D17.A | D8.A 14.51,37.43 13.59,38.35 v13.59,41.53 13.59,41.78 13.84,42.04 14.39,42.04 D15.A 19.56,43.29 C17.2 | 15.68,49.15 v13.72,49.15 | 20.83,28.19 16.01,28.19 D9.A D6.A v13.59,25.65 | v3.94,25.65 3.94,25.15 | D7.A 13.74,19.71 v13.72,19.68 | v3.94,19.56 3.94,19.18
  Bottom 1.422: C16.2 20.32,17.45 v20.32,11.85 | R6.2 33.84,17.73 U$2.GND
  Bottom 2.184: 39.37,61.79 SERVO.6
  other vias: 27.94,9.14 27.93,7.94 29.32,7.91 29.34,9.13 29.34,10.39 27.93,10.41 71.37,62.87
  cutout Bottom (isolate 0.406): 0,63 0,65 arc-90 3,68 97,68 arc-90 100,65 100,3 arc-90 97,0 3,0 arc-90 0,3
  cutout Top (isolate 0.406): 0,3 0,65 arc-90 3,68 97,68 arc-90 100,65 100,3 arc-90 97,0 3,0 arc-90
IN11
  Bottom 0.254: IC1.5 49.05,24.41 50.55,25.91 50.55,46.23 51.82,47.5 70.21,47.5 U2.7
IN11_UC  (via drill 0.3)
  Top 0.254: v91.95,46.1 91.95,48.13 91.82,48.26 79.5,48.26 78.87,47.62 74.17,47.62 v73.79,48.01
  Bottom 0.254: U1.45 91.87,46.31 v91.95,46.1 | v73.79,48.01 75.98,48.01 U2.17
IN12
  Bottom 0.254: IC1.7 48.54,26.95 50.04,28.45 50.04,46.74 51.41,48.11 U2.8
IN12_UC  (via drill 0.3)
  Top 0.254: v91.31,45.21 92.58,45.21 92.71,45.34 92.71,48.51 92.46,48.77 79.25,48.77 78.87,48.39 v78.23,48.39
  Bottom 0.254: U1.46 90.72,45.81 v91.31,45.21 | U2.16 77.85,48.77 v78.23,48.39
IN21
  Bottom 0.254: IC1.10 22.64,30.76 23.37,31.5 23.37,32.77 23.9,33.3 28.25,33.3 31.52,36.58 48.51,36.58 49.53,37.59 49.53,47.24 51.05,48.77 U2.9
IN21_UC  (1 unrouted)
  Bottom 0.254: U1.21 79.61,48.81 78.98,49.44 76.09,49.44
IN22
  Bottom 0.254: IC1.12 22.38,33.3 23.37,34.29 23.37,35.31 23.88,35.81 29.97,35.81 31.24,37.08 48.01,37.08 49.02,38.1 49.02,47.75 50.7,49.43 U2.10
IN22_UC
  Bottom 0.254: U1.22 79.85,49.31 79.08,50.08 76.1,50.08 U2.14
IN31
  Bottom 0.254: U3.3 81.31,63.47 81.03,63.75 54.61,63.75 54.1,63.25 54.1,59.44 52.83,58.17 31.5,58.17 31.24,57.91 30.86,57.53 28.7,55.37 28.7,50.29 27.94,49.53 25.87,49.53 IC2.5
IN31_UC
  Bottom 0.254: U1.25 82.48,55.04 81.96,55.56 U3.21
IN32
  Bottom 0.254: U3.4 81.97,63.83 81.53,64.26 54.36,64.26 53.59,63.5 53.59,59.69 52.58,58.67 31.24,58.67 30.99,58.42 30.61,58.04 28.19,55.63 28.19,53.09 27.23,52.13 IC2.7
IN32_UC
  Bottom 0.254: U1.26 82.98,55.32 82.62,55.68 U3.20
IN41
  Bottom 0.254: U3.5 82.63,64.44 82.3,64.77 51.56,64.77 50.8,64.01 50.8,59.44 50.55,59.18 30.73,59.18 30.48,58.93 29.84,58.29 27.49,55.94 IC2.10
IN41_UC
  Bottom 0.254: U1.27 83.48,55.6 83.26,55.82 U3.19
IN42
  Bottom 0.254: U3.6 83.26,64.82 82.8,65.28 49.02,65.28 48.26,64.52 48.26,60.2 47.75,59.69 28.96,59.69 27.74,58.48 IC2.12
IN42_UC
  Bottom 0.254: U1.28 83.98,56.78 U3.18
LED  (via drill 0.3)
  Top 0.254: v37.34,61.21 37.34,56.64 v37.08,56.39 | v65.02,50.8 65.02,44.45 65.68,43.79 78.22,43.79 v78.4,43.97
  Bottom 0.254: v37.34,61.21 37.34,63.75 36.83,64.26 17.9,64.26 R49.2 | v37.08,56.39 37.59,56.39 37.85,56.64 64.01,56.64 65.02,55.63 v65.02,50.8 | U1.15 79.84,45.81 79.5,45.47 79.5,44.45 79.02,43.97 v78.4,43.97
MOT11
  Top 1.016: IC1.2 15.44,20.6 13.45,22.6 6.63,22.6 MOT1.1
  Bottom 1.016: D6.C D2.A 6.62,22.64 MOT1.1
MOT12
  Top 1.016: MOT1.2 21.85,17.6 23.25,19 23.25,21.4 23.65,21.8 25.74,21.8 IC1.3
  Bottom 1.016: D7.C 11.54,16.95 D3.A 7.51,16.7 MOT1.2
MOT21
  Top 1.016: MOT2.1 14.64,32.79 15.25,33.4 15.25,36 16.85,37.6 22.65,37.6 23.25,37 23.25,34.8 23.45,34.6 25.79,34.6 IC1.13
  Bottom 1.016: D8.C D4.A 8.69,34.37 7.11,32.79 MOT2.1
MOT22
  Top 1.016: MOT2.2 16.01,27.76 17.25,29 17.25,35 18.05,35.8 20.69,35.8 IC1.14
  Bottom 1.016: D5.A D9.C 7.4,28.56 MOT2.2
MOT31  (via drill 0.3)
  Top 1.016: v13.46,46.1 20.41,46.1 IC2.2
  Bottom 1.016: D14.C D10.A | D10.A 7.41,46.15 6.6,45.34 MOT3.1 | D10.A 13.42,46.15 v13.46,46.1
MOT32  (via drill 0.3)
  Top 1.016: IC2.3 23.8,47.05 23.27,46.49 23.27,43.7 22.99,43.43 v13.59,43.43
  Bottom 1.016: v13.59,43.43 11.69,43.43 D15.C D11.A 9.04,40.36 MOT3.2
MOT41  (via drill 0.3)
  Top 1.016: v17.65,53.59 7.09,53.59 MOT4.1
  Bottom 1.016: IC2.13 24.2,59.75 23.37,60.58 23.37,61.72 22.35,62.74 18.67,62.74 17.65,61.72 v17.65,53.59 | D16.C D12.A 11.01,57.87 9.53,56.39 6.99,56.39 6.6,56.01 MOT4.1
MOT42  (via drill 0.3)
  Top 1.016: IC2.14 18.22,61.02 17.65,60.45 17.65,55.5 17.27,55.12 v13.59,55.12 | v13.72,51.94 9.65,51.94 8.64,50.93 8.64,50.11 MOT4.2
  Bottom 1.016: v13.59,55.12 15.6,55.12 D13.A D17.C 13.78,52.01 v13.72,51.94
N$1
  Bottom 0.254: R62.1 67.35,39.07 66.8,39.62 66.8,43.69 67.33,44.22 U2.2 70.26,44.2 71.63,44.2 71.88,44.45 71.88,45.21 72.14,45.47 74.68,45.47 arc-90 74.93,45.21 arc90 75.29,44.86 U2.22
N$2
  Bottom 0.254: U3.2 80.67,60.3 arc90 81.03,59.94 | 81.03,59.94 arc-90 81.31,59.66 U3.22 | R63.1 arc-90 78.74,59.94 81.03,59.94
N$3
  Bottom 0.813: F1.2 74.21,34.61 U$2.+5V
N$4
  Bottom 0.508: U$3.1 65.37,24.29 arc-90 65.02,24.64 arc90 64.8,24.86 T1.3
  Bottom 0.61: C8.1 61.17,24.76 T1.3
  Bottom 0.813: C8.1 58.95,27.84 F1.1
N$5
  Top 0.61: F3.1 64.4,63.89 65.28,64.77 93.98,64.77 94.49,64.26 X1.1
N$6
  Bottom 0.305: R4.2 65.85,25.76 U$3.3 65.79,25.81 T1.1
N$8
  Bottom 0.305: U$3.2 U$3.5 | U$3.6 U$3.5 | R3.2 71.94,25.21 71.68,24.94 U$3.5
N$10
  Top 0.61: F2.2 74.34,55.92 U$4.+5V
N$21
  Bottom 0.254: R49.1 14.6,64.24 R48.2 11.75,64.83 T14.1
N$24
  Bottom 0.61: T14.3 7.16,63.83 LED.1
N$28
  Bottom 0.254: U1.6 85.48,37.48 84.8,36.8 79.82,36.8 Q2.1 79.78,36.8 C28.2
N$29
  Bottom 0.254: U1.5 85.98,37.42 86.6,36.8 89.43,36.8 Q2.2 89.42,36.79 C27.2
NRST  (via drill 0.3)
  Top 0.254: v84.78,41.32 86.02,40.07 v88.52,40.07 89.35,40.07 90.42,39 90.42,20.57 89.92,20.07 v84.07,20.07 | v84.07,6.99 v84.07,15.24
  Bottom 0.254: U1.7 84.98,41.52 v84.78,41.32 | SV1.12 80.24,2.26 80.9,2.92 80.9,6.6 81.15,6.86 83.95,6.86 v84.07,6.99 | v84.07,15.24 v84.07,20.07 | v88.52,40.07 R1.1
RPI_CLK  (via drill 0.3)
  Top 0.254: v95.25,44.96 v95.25,49.4
  Bottom 0.254: SV1.23 64.36,9.11 65.15,9.91 93.6,9.91 95,11.3 95,43.81 95.25,44.07 v95.25,44.96 | U1.39 95.22,49.31 v95.25,49.4
RPI_MISO  (via drill 0.3)
  Top 0.254: v96.01,44.07 v96.01,48.64
  Bottom 0.254: SV1.21 66.9,9.11 67.18,9.4 93.98,9.4 95.5,10.92 95.5,43.56 v96.01,44.07 | U1.40 94.58,48.81 94.74,48.64 v96.01,48.64
RPI_MOSI  (via drill 0.3)
  Top 0.254: v96.39,42.93 96.77,43.31 v96.77,47.88
  Bottom 0.254: SV1.19 69.44,8.61 69.72,8.89 94.36,8.89 96.01,10.54 96.01,42.55 v96.39,42.93 | v96.77,47.88 94.74,47.88 94.31,48.31 U1.41
RPI_RXD
  Bottom 0.254: SV1.10 82.14,1.68 82.68,1.14 93.85,1.14 95.12,2.41 95.12,6.99 97.54,9.4 97.54,40.64 98.42,41.53 98.42,45.21 97.41,46.23 95.03,46.23 93.45,47.81 U1.42
RPI_TXD
  Bottom 0.254: SV1.8 85.98,3.56 85.98,7.62 86.23,7.87 95.12,7.87 97.03,9.78 97.03,41.02 97.79,41.78 97.79,44.96 97.03,45.72 94.74,45.72 93.15,47.31 U1.43
SCL  (via drill 0.3)
  Top 0.254: SV1.5 87.22,13.05 v87.25,13.08 | v50.42,13.08 v50.42,6.35 | v94.26,39.88 94.26,40.23 93.22,41.27 93.22,44.32 93.73,44.83 v93.73,51.31
  Bottom 0.254: R60.1 50.67,7.65 | 50.67,7.65 53.12,7.65 55.88,10.41 93.22,10.41 94.49,11.68 94.49,39.65 v94.26,39.88 | v93.73,51.31 93.73,52.58 92.96,53.34 88.14,53.34 87.48,52.68 U1.35 | v87.25,13.08 v50.42,13.08 | v50.42,6.35 50.42,7.4 50.67,7.65
SDA  (via drill 0.3)
  Top 0.254: v92.71,51.31 93.09,50.93 93.22,50.8 93.22,45.09 92.71,44.58 92.71,40.39 93.75,39.34 v93.75,38.99 | SV1.3 89.76,12.03 v89.79,12.06
  Bottom 0.254: R59.1 46.77,10.92 46.99,10.92 | 46.99,10.92 92.71,10.92 93.98,12.19 93.98,38.77 v93.75,38.99 | v92.71,51.31 92.71,52.32 92.2,52.83 88.39,52.83 87.98,52.42 U1.36 | v89.79,12.06 48.13,12.06 46.99,10.92
SEN1  (via drill 0.3)
  Top 0.254: 81.03,41.66 v81.28,41.66 v63.75,41.66
  Bottom 0.254: C11.1 32.84,23.37 50.04,23.37 53.59,26.92 53.59,36.32 55.63,38.35 55.63,39.12 55.37,39.37 55.37,42.67 55.88,43.18 62.23,43.18 v63.75,41.66 | U1.10 83.48,42.35 82.86,41.73 81.36,41.73 v81.28,41.66
  Bottom 0.305: IC1.1 25.87,19.39 C11.1
  Bottom 1.422: R6.1 25.81,15.3 IC1.1
SEN2  (via drill 0.3)
  Top 0.254: v47.24,38.35 54.61,38.35 54.86,38.61 v54.86,38.86 | v63.75,42.93 64.52,42.16 80.52,42.16 v81.28,42.93
  Top 1.422: IC1.15 25.81,41 R5.1
  Bottom 0.254: IC1.15 27.29,37.11 C12.1 28.62,39.54 29.46,40.39 36.32,40.39 36.83,39.88 36.83,38.1 37.34,37.59 46.99,37.59 47.24,37.85 v47.24,38.35 | v54.86,38.86 54.86,43.18 55.47,43.79 62.43,43.79 63.3,42.93 v63.75,42.93 | U1.11 82.98,42.52 82.8,42.34 81.79,42.34 v81.28,42.93
SEN3  (via drill 0.3)
  Top 0.254: 25.85,44.51 27.43,42.93 v27.43,40.64 | v46.23,38.35 46.23,38.86 46.48,39.12 v53.85,39.12 | v63.75,43.94 64.01,43.94 65.28,42.67 80.01,42.67 v81.28,43.94
  Top 0.305: IC2.1 25.85,44.51
  Top 1.422: IC2.1 28.38,44.51 29.35,45.47 R7.1
  Bottom 0.254: v27.43,40.64 27.94,40.64 28.45,41.15 36.58,41.15 37.34,40.39 37.34,38.35 37.59,38.1 45.97,38.1 | v53.85,39.12 53.85,43.48 54.74,44.37 63.58,44.37 63.75,44.2 v63.75,43.94 | v81.28,43.94 81.84,43.94 U1.12
  Bottom 0.305: C13.1 26.54,45.23 IC2.1 | 45.97,38.1 v46.23,38.35
SEN4  (via drill 0.3)
  Top 0.254: v36.07,60.45 v36.07,56.39 | v64.01,50.8 64.01,44.7 65.53,43.18 79.25,43.18 v80.01,43.94
  Top 1.422: IC2.15 28.85,62.29 R8.1
  Bottom 0.254: v36.07,60.45 36.07,61.21 33.78,63.5 29.72,63.5 29.13,62.91 C14.1 25.92,62.18 IC2.15 | v36.07,56.39 36.07,56.13 36.58,55.63 37.59,55.63 38.1,56.13 62.99,56.13 64.01,55.12 v64.01,50.8 | v80.01,43.94 80.11,43.94 U1.13
SERVO1
  Bottom 0.254: SERVO.3 47.06,64.58 48.26,65.79 83.57,65.79 83.92,65.43 U3.7
SERVO1_UC
  Bottom 0.254: U1.29 84.48,55.8 84.56,55.88 U3.17
SERVO2
  Bottom 0.254: SERVO.4 44.52,65.09 45.72,66.29 84.07,66.29 84.58,65.79 84.58,62.7 U3.8
SERVO2_UC
  Bottom 0.254: U1.30 84.98,55.56 85.22,55.8 U3.16 | U3.16
SERVO3
  Bottom 0.254: U3.9 85.22,66.16 84.58,66.8 43.43,66.8 41.98,65.35 SERVO.5
SERVO3_UC
  Bottom 0.254: U1.31 85.48,55.34 85.88,55.74 U3.15
SPI1_NSS  (via drill 0.3)
  Top 0.254: v97.28,49.78 97.54,49.53 97.54,42.67 v97.03,42.16
  Bottom 0.254: SV1.24 64.36,3.02 64.9,3.56 73.27,3.56 SV1.15 74.52,8.1 74.8,8.38 94.74,8.38 96.52,10.16 96.52,41.66 v97.03,42.16 | v97.28,49.78 96.9,50.16 94.87,50.16 94.61,49.91 | U1.38 94.51,49.81 94.61,49.91 | R61.1 93.38,55.09 94.61,53.85 94.61,49.91
SWCLK  (via drill 0.3)
  Top 0.254: v91.19,50.8 91.19,51.94 92.33,53.09 97.28,53.09 98.04,52.32 98.04,42.04 95.76,39.75 95.76,28.96 94.61,27.81 92.33,27.81 91.95,27.43 91.95,19.68 91.57,19.3 v83.31,19.3 | v62.74,14.1 v62.74,9.72
  Bottom 0.254: U1.37 90.69,50.31 v91.19,50.8 | v83.31,19.3 83.31,15.88 82.42,14.99 78.99,14.99 77.6,13.59 63.25,13.59 v62.74,14.1 | v62.74,9.72 62.74,6.35 63.12,5.97 63.12,1.27 63.25,1.14 66.55,1.14 66.93,1.52 66.93,2.23 SV1.22
SWDIO  (via drill 0.3)
  Top 0.254: v82.17,18.92 82.55,18.54 91.82,18.54 92.46,19.18 92.46,27.18 92.58,27.3 94.87,27.3 96.27,28.7 96.27,39.5 98.55,41.78 98.55,52.7 97.16,54.1 v93.09,54.1 | v77.47,14.99 77.47,8.89 v75.95,7.37
  Bottom 0.254: U1.34 86.98,53.07 87.76,53.85 92.84,53.85 v93.09,54.1 | v82.17,18.92 82.17,16.13 81.66,15.62 78.11,15.62 v77.47,14.99 | v75.95,7.37 75.82,7.24 75.82,1.52 75.44,1.14 72.14,1.14 72.01,1.27 72.01,2.23 SV1.18
VCC  (via drill 0.3)
  Top 0.305: 23.88,33.3 28.25,33.3
  Top 0.406: v39.4,44.48 arc90 39.37,44.45 | 23.88,33.3 23.12,32.54 23.12,24.09 22.19,23.16 22.19,23.14 IC1.4 | 28.25,33.3 28.47,33.51 28.45,42.14 v28.33,42.34
  Top 0.61: IC2.4 22.1,48.32 23.37,49.59 23.37,62.74 22.35,63.75 10.41,63.75 9.65,62.99 9.65,58.8 9.14,58.29 7.11,58.29 | v18.29,40.89 22.1,40.89 v23.62,39.37 | 7.11,58.29 6.66,58.29 LED.2 | v8.51,54.99 8.51,56.9 7.11,58.29
  Top 1.93: 39.37,33.78 40.39,32.77 40.39,9.65 40.39,8.69 C5.+ | 39.37,33.78 38.61,34.54 34.6,34.54 U$2.IN+ | U$4.IN+ 34.59,51.01 36.58,49.02 38.35,49.02 39.37,48.01 39.37,44.45 39.37,33.78
  Bottom 0.254: v39.4,44.48 43.08,44.48 R45.2
  Bottom 0.305: X3.1 14.61,5
  Bottom 0.406: v28.33,42.34 28.15,42.34 28.07,42.42
  Bottom 0.61: C6.1 6.54,58.31 LED.2 | 22.1,37.85 v23.62,39.37 23.62,42.42 | D12.C 14.04,56.26 12.95,56.26 11.76,55.07 D13.C 8.59,55.07 v8.51,54.99
  Bottom 1.016: C16.1 22.34,18.09 23.25,19 23.25,22.8 22.85,23.2 20.79,23.2 IC1.4 17.91,23.14 | 23.62,42.42 23.27,42.77 23.27,43.18 | 23.27,43.18 23.27,47.47 22.42,48.32 IC2.4 20.68,48.26 19.43,48.26 17.32,46.15 D10.C | C17.1 21.76,43.18 23.27,43.18 | D11.C 17.75,40.36 v18.29,40.89 17.78,40.39 17.78,35.81 16.33,34.37 D4.C D5.C | 17.91,23.14 16.14,23.14 D2.C | D3.C 17.72,16.7 18.03,17.02 18.03,23.02 17.91,23.14
  Bottom 1.422: 22.45,17.46 C16.1 | 23.62,42.42 28.07,42.42 33.02,42.42 34.8,44.2 34.8,55.66 U$4.IN+
  Bottom 1.93: 22.45,17.46 22.45,6.48 20.98,5 14.61,5 POWER_CON.2

### Text on the board
tNames: MANIPULATOR | wired if one / manipulator / power supply | secondary / manipulator / power supply | 7V | 5V | GND | GND | VCC | VCC
bNames: STM32F030C8T6